# Altium schematic sheet eMMC_SD.SchDoc
size A3; SheetNumber: 18; SheetTotal: 21
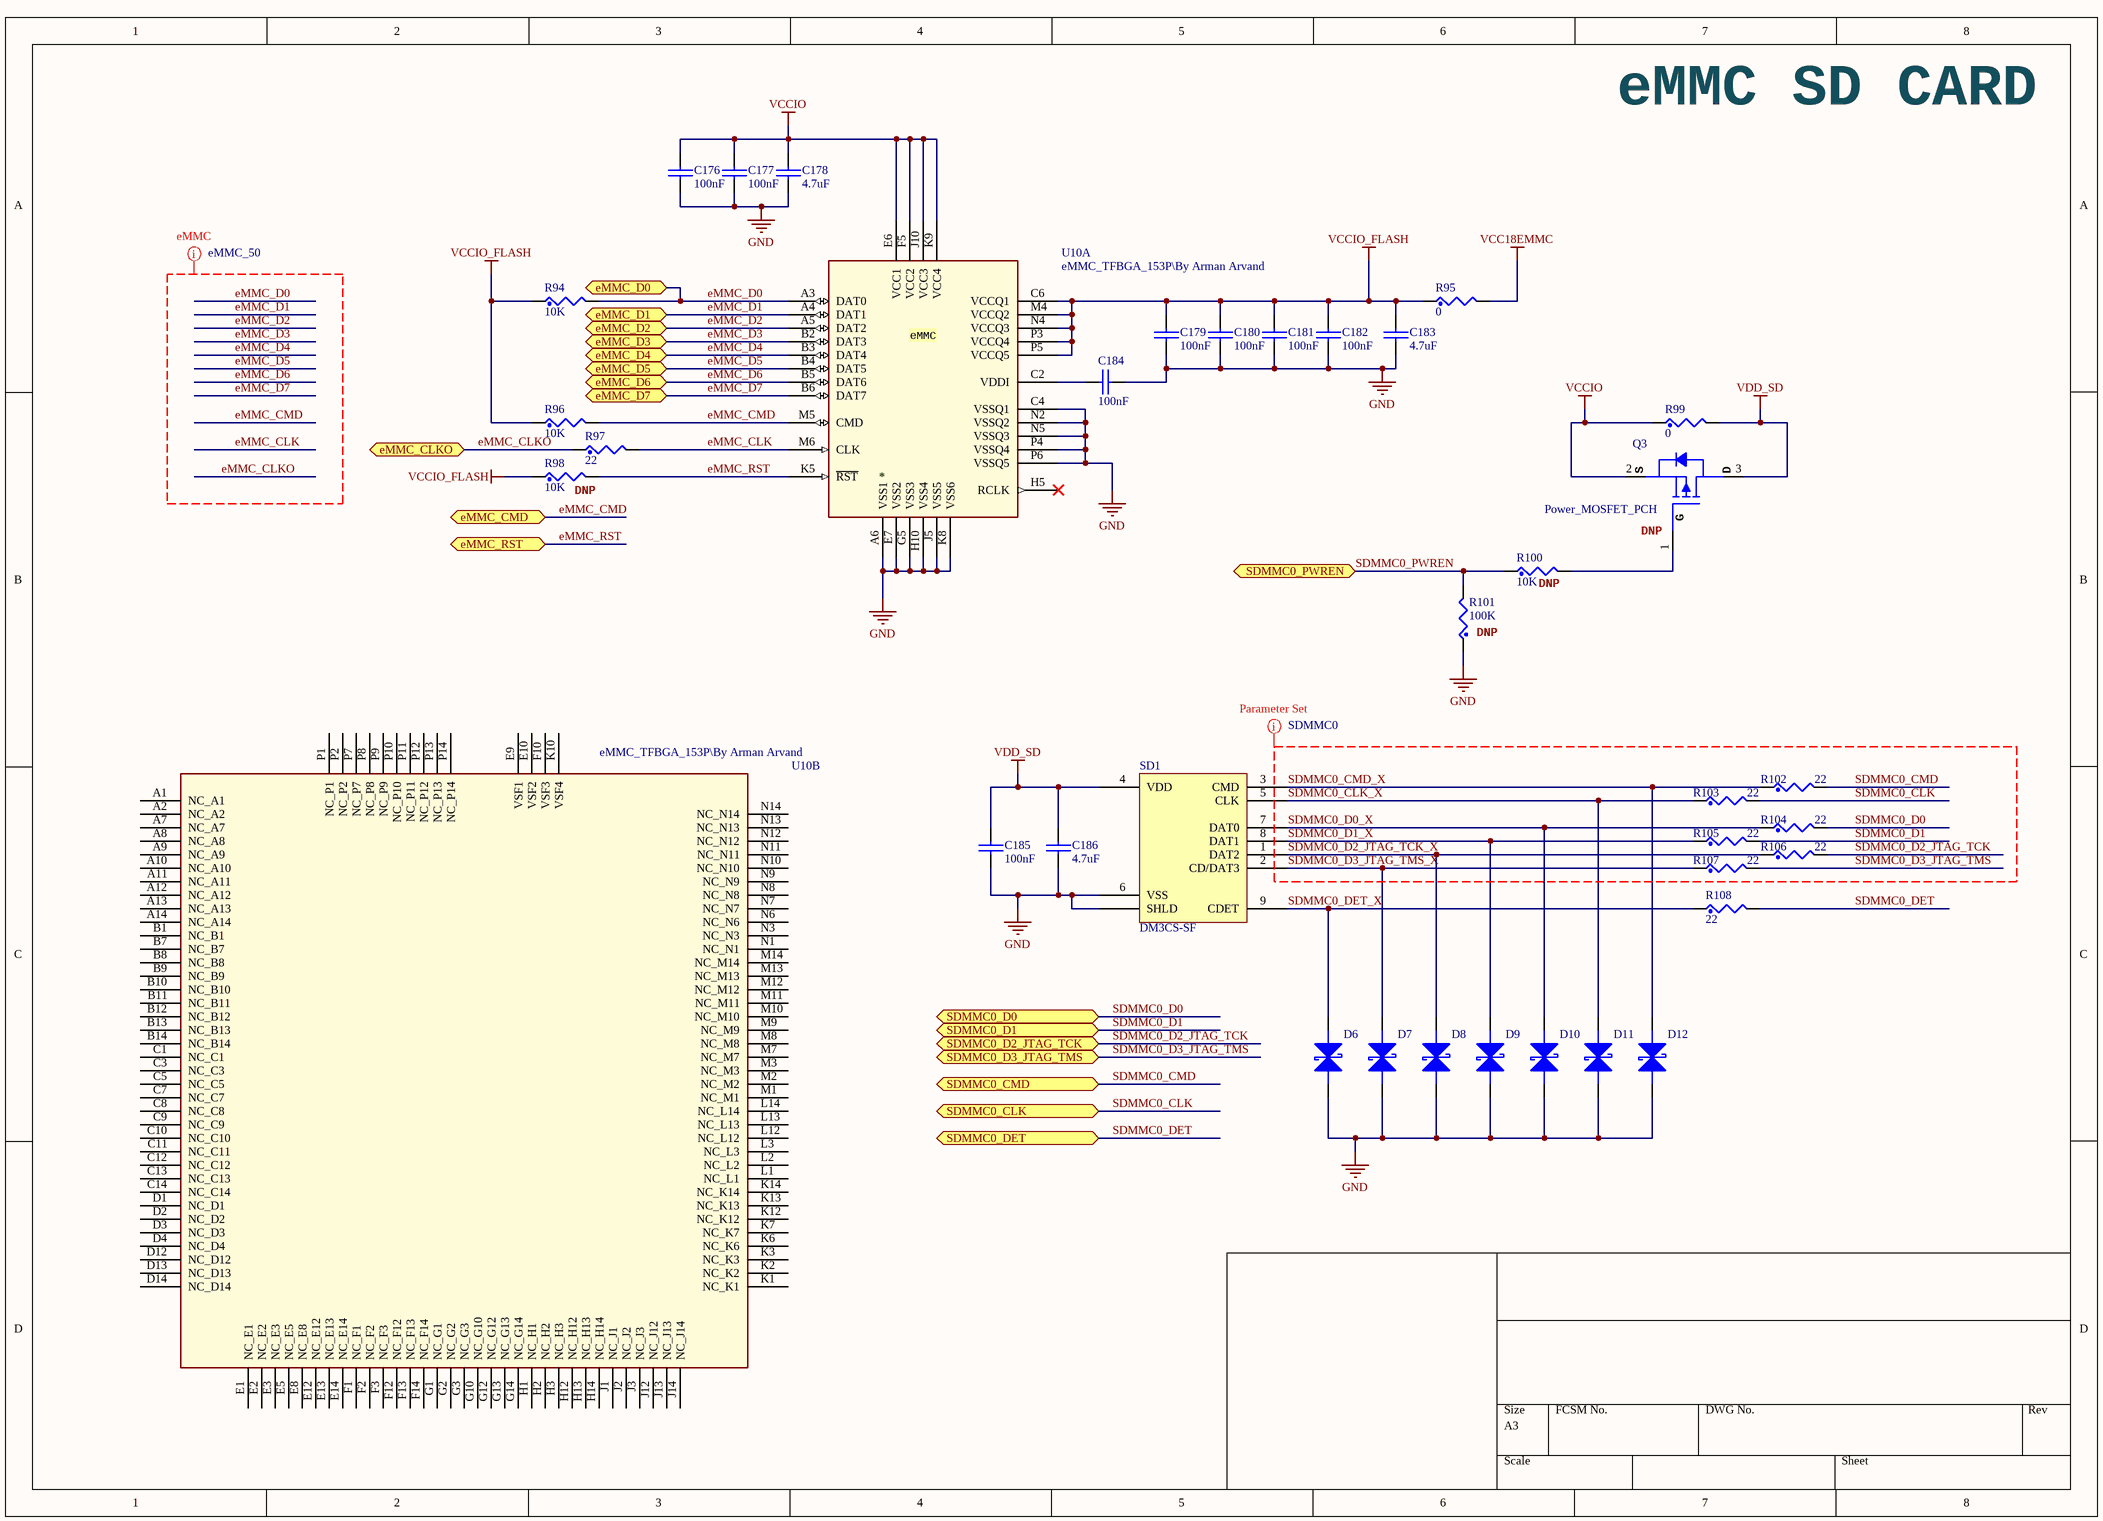
[diagram p0: eMMC_SD.SchDoc]

## Parts
C176  100nF  [0402_CC - C]
C177  100nF  [0402_CC - C]
C178  4.7uF  [0603_CC]
C179  100nF  [0402_CC - C]
C180  100nF  [0402_CC - C]
C181  100nF  [0402_CC - C]
C182  100nF  [0402_CC - C]
C183  4.7uF  [0603_CC]
C184  100nF  [0402_CC - C]
C185  100nF  [0402_CC - C]
C186  4.7uF  [0603_CC]
D6  PGB1010603MR  [TVS0603]  (value not drawn)
D7  PGB1010603MR  [TVS0603]  (value not drawn)
D8  PGB1010603MR  [TVS0603]  (value not drawn)
D9  PGB1010603MR  [TVS0603]  (value not drawn)
D10  PGB1010603MR  [TVS0603]  (value not drawn)
D11  PGB1010603MR  [TVS0603]  (value not drawn)
D12  PGB1010603MR  [TVS0603]  (value not drawn)
Q3  Power_MOSFET_PCH  [SOT95P240X130-3N]
R94  10K  [0402_CR]
R95  0  [0402_CR]
R96  10K  [0402_CR]
R97  22  [0402_CR]
R98  10K  [0402_CR]
R99  0  [0402_CR]
R100  10K  [0402_CR]
R101  100K  [0402_CR]
R102  22  [0402_CR]
R103  22  [0402_CR]
R104  22  [0402_CR]
R105  22  [0402_CR]
R106  22  [0402_CR]
R107  22  [0402_CR]
R108  22  [0402_CR]
SD1  DM3CS-SF  [HIROSE DM3CS]
U10  eMMC_TFBGA_153P\By Arman Arvand  [TFBGA153_0P5_11.5X13X1.2]  (parts A,B of 2)

## Ports
eMMC_CLKO (bidir), eMMC_CMD (bidir), eMMC_D0 (bidir), eMMC_D1 (bidir), eMMC_D2 (bidir), eMMC_D3 (bidir), eMMC_D4 (bidir), eMMC_D5 (bidir), eMMC_D6 (bidir), eMMC_D7 (bidir), eMMC_RST (bidir), SDMMC0_CLK (bidir), SDMMC0_CMD (bidir), SDMMC0_D0 (bidir), SDMMC0_D1 (bidir), SDMMC0_D2_JTAG_TCK (bidir), SDMMC0_D3_JTAG_TMS (bidir), SDMMC0_DET (bidir), SDMMC0_PWREN (bidir)

## Nets
GND: C176.2 C177.2 C178.2 C179.2 C180.2 C181.2 C182.2 C183.2 C184.2 C185.2 C186.2 D6.2 D7.2 D8.2 D9.2 D10.2 D11.2 D12.2 R101.1 SD1.6(VSS) SD1.S(SHLD) U10.A6(VSS1) U10.C4(VSSQ1) U10.E7(VSS2) U10.G5(VSS3) U10.H10(VSS4) U10.J5(VSS5) U10.K8(VSS6) U10.N2(VSSQ2) U10.N5(VSSQ3) U10.P4(VSSQ4) U10.P6(VSSQ5)
VCC18EMMC: R95.2
VCCIO: C176.1 C177.1 C178.1 Q3.2 R99.1 U10.E6(VCC1) U10.F5(VCC2) U10.J10(VCC3) U10.K9(VCC4)
VCCIO_FLASH: C179.1 C180.1 C181.1 C182.1 C183.1 R94.1 R95.1 R96.1 R98.1 U10.C6(VCCQ1) U10.M4(VCCQ2) U10.N4(VCCQ3) U10.P3(VCCQ4) U10.P5(VCCQ5)
VDD_SD: C185.1 C186.1 Q3.3 R99.2 SD1.4(VDD)
eMMC_CLK: R97.2 U10.M6(CLK)
eMMC_CLKO: R97.1 ; port eMMC_CLKO
eMMC_CMD: R96.2 U10.M5(CMD) ; port eMMC_CMD
eMMC_D0: R94.2 U10.A3(DAT0) ; port eMMC_D0
eMMC_D1: U10.A4(DAT1) ; port eMMC_D1
eMMC_D2: U10.A5(DAT2) ; port eMMC_D2
eMMC_D3: U10.B2(DAT3) ; port eMMC_D3
eMMC_D4: U10.B3(DAT4) ; port eMMC_D4
eMMC_D5: U10.B4(DAT5) ; port eMMC_D5
eMMC_D6: U10.B5(DAT6) ; port eMMC_D6
eMMC_D7: U10.B6(DAT7) ; port eMMC_D7
eMMC_RST: R98.2 U10.K5(~{RST}) ; port eMMC_RST
SDMMC0_CLK: R103.2 ; port SDMMC0_CLK
SDMMC0_CLK_X: D11.1 R103.1 SD1.5(CLK)
SDMMC0_CMD: R102.2 ; port SDMMC0_CMD
SDMMC0_CMD_X: D12.1 R102.1 SD1.3(CMD)
SDMMC0_D0: R104.2 ; port SDMMC0_D0
SDMMC0_D0_X: D10.1 R104.1 SD1.7(DAT0)
SDMMC0_D1: R105.2 ; port SDMMC0_D1
SDMMC0_D1_X: D9.1 R105.1 SD1.8(DAT1)
SDMMC0_D2_JTAG_TCK: R106.2 ; port SDMMC0_D2_JTAG_TCK
SDMMC0_D2_JTAG_TCK_X: D8.1 R106.1 SD1.1(DAT2)
SDMMC0_D3_JTAG_TMS: R107.2 ; port SDMMC0_D3_JTAG_TMS
SDMMC0_D3_JTAG_TMS_X: D7.1 R107.1 SD1.2(CD/DAT3)
SDMMC0_DET: R108.2 ; port SDMMC0_DET
SDMMC0_DET_X: D6.1 R108.1 SD1.9(CDET)
SDMMC0_PWREN: R100.1 R101.2 ; port SDMMC0_PWREN
NetC184_1: C184.1 U10.C2(VDDI)
NetQ3_1: Q3.1 R100.2

Not connected (* = marked no-connect by the designer): U10 A1(NC_A1) A2(NC_A2) A7(NC_A7) A8(NC_A8) A9(NC_A9) A10(NC_A10) A11(NC_A11) A12(NC_A12) A13(NC_A13) A14(NC_A14) B1(NC_B1) B7(NC_B7) B8(NC_B8) B9(NC_B9) B10(NC_B10) B11(NC_B11) B12(NC_B12) B13(NC_B13) B14(NC_B14) C1(NC_C1) C3(NC_C3) C5(NC_C5) C7(NC_C7) C8(NC_C8) C9(NC_C9) C10(NC_C10) C11(NC_C11) C12(NC_C12) C13(NC_C13) C14(NC_C14) D1(NC_D1) D2(NC_D2) D3(NC_D3) D4(NC_D4) D12(NC_D12) D13(NC_D13) D14(NC_D14) E1(NC_E1) E2(NC_E2) E3(NC_E3) E5(NC_E5) E8(NC_E8) E9(VSF1) E10(VSF2) E12(NC_E12) E13(NC_E13) E14(NC_E14) F1(NC_F1) F2(NC_F2) F3(NC_F3) F10(VSF3) F12(NC_F12) F13(NC_F13) F14(NC_F14) G1(NC_G1) G2(NC_G2) G3(NC_G3) G10(NC_G10) G12(NC_G12) G13(NC_G13) G14(NC_G14) H1(NC_H1) H2(NC_H2) H3(NC_H3) H5(RCLK)* H12(NC_H12) H13(NC_H13) H14(NC_H14) J1(NC_J1) J2(NC_J2) J3(NC_J3) J12(NC_J12) J13(NC_J13) J14(NC_J14) K1(NC_K1) K2(NC_K2) K3(NC_K3) K6(NC_K6) K7(NC_K7) K10(VSF4) K12(NC_K12) K13(NC_K13) K14(NC_K14) L1(NC_L1) L2(NC_L2) L3(NC_L3) L12(NC_L12) L13(NC_L13) L14(NC_L14) M1(NC_M1) M2(NC_M2) M3(NC_M3) M7(NC_M7) M8(NC_M8) M9(NC_M9) M10(NC_M10) M11(NC_M11) M12(NC_M12) M13(NC_M13) M14(NC_M14) N1(NC_N1) N3(NC_N3) N6(NC_N6) N7(NC_N7) N8(NC_N8) N9(NC_N9) N10(NC_N10) N11(NC_N11) N12(NC_N12) N13(NC_N13) N14(NC_N14) P1(NC_P1) P2(NC_P2) P7(NC_P7) P8(NC_P8) P9(NC_P9) P10(NC_P10) P11(NC_P11) P12(NC_P12) P13(NC_P13) P14(NC_P14)

## Layout directives
net class eMMC_50: eMMC_CLK, eMMC_CLKO, eMMC_CMD, eMMC_D0, eMMC_D1, eMMC_D2, eMMC_D3, eMMC_D4, eMMC_D5, eMMC_D6, eMMC_D7
net class SDMMC0: SDMMC0_CLK, SDMMC0_CLK_X, SDMMC0_CMD, SDMMC0_CMD_X, SDMMC0_D0, SDMMC0_D0_X, SDMMC0_D1, SDMMC0_D1_X, SDMMC0_D2_JTAG_TCK, SDMMC0_D2_JTAG_TCK_X, SDMMC0_D3_JTAG_TMS, SDMMC0_D3_JTAG_TMS_X

## Notes on the sheet
- eMMC SD CARD
- (near R98) DNP
- (near Q3) DNP
- (near R100) DNP
- (near R101) DNP
- (in symbol MTFC4GMWDM-3M AIT A, part A) eMMC
- (in symbol WPM2015-3/TR) S; D; G

## Library data of the parts
C176-C186 = CAP_NP: CLASS: DISCRETE
D6-D12 = PGB1010603MR: SUPPRESSOR ESD 24VDC 0603 SMD; Manufacturer: Littelfuse Inc; Voltage - Reverse Standoff (Typ): 24V; Polarization: Bidirectional; Supplier 1: Digi-Key; Manufacturer Part Number: PGB1010603MR; RoHS: RoHS Compliant; Category: Circuit Protection; Stock 1: 155406; Pricing 1: 1=0.66, 10=0.556, 25=0.4872, 100=0.4172, 250=0.3618, 500=0.30646 (USD); Packaging: Cut Tape (CT); Voltage - Breakdown: -; Power (Watts): -; Mounting Type: Surface Mount; Package / Case: 0603 (1608 Metric); Supplier Device Package: 0603 (1608 Metric); ComponentLink1URL: http://www.littelfuse.com/data/en/Data_Sheets/Littelfuse_PulseGuard-ESD_PGB1.pdf; ComponentLink1Description: http://www.littelfuse.com/data/en/Data_Sheets/Littelfuse_PulseGuard-ESD_PGB1.pdf; Supplier Part Number 1: F2594CT-ND
Q3 = WPM2015-3/TR: WPM2015 , Single P-Channel, -20V, -2.4A, Power MOSFET , By Arman Arvand; Pakage: SOT-23(SOT-23-3); Footprint: SOT23_3; Mfr_Part_No: WPM2015-3/TR; LCSC Part #: C213159; ComponentLink1Description: LCSC Link; ComponentLink1URL: https://lcsc.com/product-detail/MOSFET_WILLSEMI-Will-Semicon-WPM2015-3-TR_C213159.html; ComponentLink2Description: DigiPart; ComponentLink2URL: https://www.digipart.com/part/WPM2015-3
R94-R108 = RES: CLASS: DISCRETE
SD1 = DM3CS-SF: CONN MICRO SD CARD HINGED TYPE; Manufacturer: Hirose Electric Co Ltd; Card Type: Secure Digital - microSD™; Connector Type: Connector; Insertion, Removal Method: Hinged Lid; Number of Positions: 10 (8 + 2); Part Number: DM3CS-SF; ComponentLink1Description: Datasheet; ComponentLink1URL: https://www.hirose.com/product/document?clcode=CL0609-0033-6-00&productname=DM3AT-SF-PEJ2M5&series=DM3&documenttype=Catalog&lang=en&documentid=D49662_en; ComponentLink2Description: DigiKey Link; ComponentLink2URL: //digikey.com/product-detail/en/hirose-electric-co-ltd/DM3CS-SF/HR1972TR-ND/2602739; Contact Finish: Gold; Features: Switch; Height Above Board: 0.072" (1.83mm); LastUpdated: 12/16/2019 8:36:12 PM; Lifecycle Status: 0; Minimum Order: 1; Mounting Feature: Normal, Standard - Top; Mounting Type: Surface Mount, Right Angle; Packaging: TapeAndReel; Part Status: Active; Price: 0.77; Series: DM3; Supplier 1: DigiKey; Supplier Part Number 1: HR1972TR-ND
U10 = MTFC4GMWDM-3M AIT A: MTFC4GMWDM-3M_AIT_A_TFBGA_153P\By Arman Arvand note!  pin A6 in eMMC V4.51 must be NC(RFU); Mfr_Part_No_1: MTFC4GLGDM-AIT A; CLASS: IC; ComponentLink1Description: Supplier; ComponentLink1URL: https://www.micron.com/products/managed-nand/emmc/part-catalog/mtfc4gmwdm-3m-ait-a?modal={89F0AB92-C039-4EF6-850D-62E989ADCE61}&did={5C81622E-64E0-46E7-8D9C-79804698EA07}; ComponentLink2Description: Mouser link; ComponentLink2URL: https://www.mouser.com/ProductDetail/Micron/MTFC4GMWDM-3M-AIT-A?qs=vLWxofP3U2wAo2cXgoPupQ%3D%3D; Mouser No 1: 340-397841-TRAY; Mfr_Part_No_2: MTFC4GMWDM-3M AIT A; Mouser No 2: 340-397035-TRAY; Mfr_Part_No_3: MTFC4GLGDM-AIT A; Mouser No 3: 340-397841-TRAY